# Altium schematic sheet Voltage Regulators.SchDoc
size A4; SheetNumber: 4; SheetTotal: 11
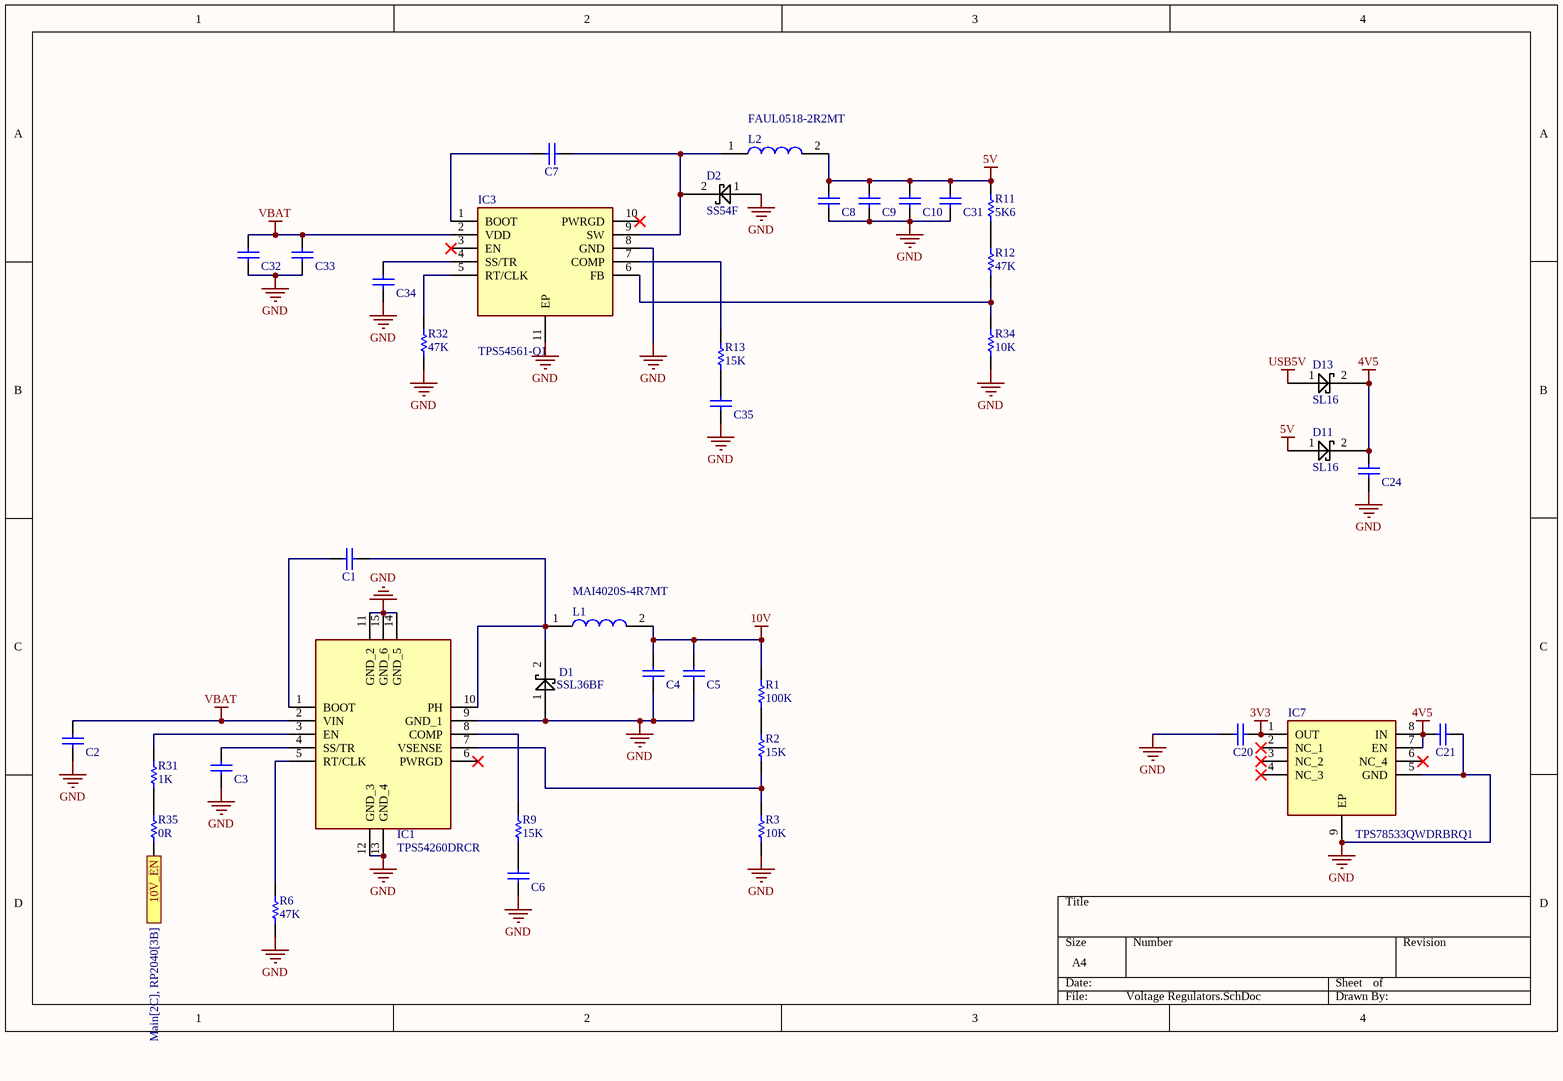
[diagram p0: Voltage Regulators.SchDoc]

## Parts
C1  100nF  [WCAP-CSGP_0603_L1.6W0.8H0.8_Reflow]  (value not drawn)
C2  3.3µF  [WCAP-CSGP_1206_L3.2W1.6H1.6]  (value not drawn)
C3  10nF  [WCAP-CSGP_0603_L1.6W0.8H0.8_Reflow]  (value not drawn)
C4  4.7µF  [WCAP-CSGP_0805_L2W1.25H1.25]  (value not drawn)
C5  4.7µF  [WCAP-CSGP_0805_L2W1.25H1.25]  (value not drawn)
C6  2.5pF  [WCAP-CSGP_0603_L1.6W0.8H0.8_Reflow]  (value not drawn)
C7  100nF  [WCAP-CSGP_0603_L1.6W0.8H0.8_Reflow]  (value not drawn)
C8  4.7µF  [WCAP-CSGP_0805_L2W1.25H1.25]  (value not drawn)
C9  4.7µF  [WCAP-CSGP_0805_L2W1.25H1.25]  (value not drawn)
C10  4.7µF  [WCAP-CSGP_0805_L2W1.25H1.25]  (value not drawn)
C20  1µF  [WCAP-CSGP_0603_L1.6W0.8H0.8_Reflow]  (value not drawn)
C21  1µF  [WCAP-CSGP_0603_L1.6W0.8H0.8_Reflow]  (value not drawn)
C24  1µF  [WCAP-CSGP_0603_L1.6W0.8H0.8_Reflow]  (value not drawn)
C31  4.7µF  [WCAP-CSGP_0805_L2W1.25H1.25]  (value not drawn)
C32  2.2µF  [WCAP-CSGP_0805_L2W1.25H1.25]  (value not drawn)
C33  2.2µF  [WCAP-CSGP_0805_L2W1.25H1.25]  (value not drawn)
C34  10nF  [WCAP-CSGP_0603_L1.6W0.8H0.8_Reflow]  (value not drawn)
C35  1nF  [WCAP-CSGP_0603_L1.6W0.8H0.8_Reflow]  (value not drawn)
D1  SSL36BF  [SSL36BF]
D2  SS54F  [SS54F]
D11  SL16  [SL16]
D13  SL16  [SL16]
IC1  TPS54260DRCR  [TPS54040ADRCT]
IC3  TPS54561-Q1  [SON80P400X400X80-11N]
IC7  TPS78533QWDRBRQ1  [SON65P300X300X100-9N-D]
L1  MAI4020S-4R7MT  [MAI4020S-4R7MT]
L2  FAUL0518-2R2MT  [FAUL0518-2R2MT]
R1  100K  [RESC0603(1608)_N]
R2  15K  [RESC0603(1608)_N]
R3  10K  [RESC0603(1608)_N]
R6  47K  [RESC0603(1608)_N]
R9  15K  [RESC0603(1608)_N]
R11  5K6  [RESC0603(1608)_N]
R12  47K  [RESC0603(1608)_N]
R13  15K  [RESC0603(1608)_N]
R31  1K  [RESC0603(1608)_N]
R32  47K  [RESC0603(1608)_N]
R34  10K  [RESC0603(1608)_N]
R35  0R  [RESC0603(1608)_N]

## Ports
10V_EN (see Main[2C], RP2040[3B])

## Nets
3V3: C20.2 IC7.1(OUT)
4V5: C21.1 C24.2 D11.2 D13.2 IC7.7(EN) IC7.8(IN)
5V: C8.2 C9.2 C10.2 C31.2 D11.1 L2.2 R11.2
10V: C4.2 C5.2 L1.2 R1.2
GND: C2.1 C3.1 C4.1 C5.1 C6.1 C8.1 C9.1 C10.1 C20.1 C21.2 C24.1 C31.1 C32.1 C33.1 C34.1 C35.1 D1.1 D2.1 IC1.9(GND_1) IC1.11(GND_2) IC1.12(GND_3) IC1.13(GND_4) IC1.14(GND_5) IC1.15(GND_6) IC3.8(GND) IC3.11(EP) IC7.5(GND) IC7.9(EP) R3.1 R6.1 R32.1 R34.1
USB5V: D13.1
VBAT: C2.2 C32.2 C33.2 IC1.2(VIN) IC3.2(VDD)
10V_EN: R35.1 ; port 10V_EN
NetC1_1: C1.1 IC1.1(BOOT)
NetC1_2: C1.2 D1.2 IC1.10(PH) L1.1
NetC3_2: C3.2 IC1.4(SS/TR)
NetC6_2: C6.2 R9.1
NetC7_1: C7.1 IC3.1(BOOT)
NetC7_2: C7.2 D2.2 IC3.9(SW) L2.1
NetC34_2: C34.2 IC3.4(SS/TR)
NetC35_2: C35.2 R13.1
NetIC1_3: IC1.3(EN) R31.2
NetIC1_5: IC1.5(RT/CLK) R6.2
NetIC1_7: IC1.7(VSENSE) R2.1 R3.2
NetIC1_8: IC1.8(COMP) R9.2
NetIC3_5: IC3.5(RT/CLK) R32.2
NetIC3_6: IC3.6(FB) R12.1 R34.2
NetIC3_7: IC3.7(COMP) R13.2
NetR1_1: R1.1 R2.2
NetR11_1: R11.1 R12.2
NetR31_1: R31.1 R35.2

Not connected (* = marked no-connect by the designer): IC1 6(PWRGD)*; IC3 3(EN)* 10(PWRGD)*; IC7 2(NC_1)* 3(NC_2)* 4(NC_3)* 6(NC_4)*

## Library data of the parts
C1 C7 = 885012206046: WCAP-CSGP Multilayer Ceramic Chip Capacitor, General Purpose, size 0603, X7R, 100nF, 16VDC; Manufacturer: Wurth Elektronik; Case/Size Code: 0603; Capacitance Tolerance: +/-10%; Dissipation Factor: 3.5%; Insulation Resistance: 5GΩ; Rated Voltage (DC): 16V; Technical Reference: X7R0603104K016DFCT10000; ComponentLink1Description: Website Link; ComponentLink1URL: https://www.we-online.com/redexpert/article/885012206046?ad; ComponentLink2Description: Datasheet Link; ComponentLink2URL: https://www.we-online.com/redexpert/spec/885012206046?ad; Manufacturer Part Number: 885012206046; Category: Multilayer Ceramic Chip Capacitors; Match Code: WCAP-CSGP; Mount: Surface Mount; Operating Temperature Max: 125°C; Operating Temperature Min: -55°C; Packaging: Tape and Reel; Length: 1.6mm; Width: 0.8mm; Height: 0.8mm; Capacitance: 100nF; Ceramic Type: X7R
C2 = 885012208124: TDK C3216X7S2A335KT000N / 3.3µF MLCC 1206 100V X7S; Manufacturer: Wurth Elektronik; Match Code: WCAP-CSGP; Case/Size Code: 1206; Capacitance: 2.2µF; Capacitance Tolerance: +/-10%; Ceramic Type: X7R; Dissipation Factor: 5%; Insulation Resistance: 0.05GΩ; Technical Reference: X7R1206225K100DFCT10000; ComponentLink1Description: Website Link; ComponentLink1URL: https://www.we-online.com/redexpert/article/885012208124?ad; ComponentLink2Description: Datasheet Link; ComponentLink2URL: https://www.we-online.com/redexpert/spec/885012208124?ad; Manufacturer Part Number: 885012208124; Category: Multilayer Ceramic Chip Capacitors; Mount: Surface Mount; Operating Temperature Max: 125°C; Operating Temperature Min: -55°C; Packaging: Tape and Reel; Length: 3.2mm; Width: 1.6mm; Height: 1.6mm; Rated Voltage (DC): 100V
C3 C34 = 885012206040: WCAP-CSGP Multilayer Ceramic Chip Capacitor, General Purpose, size 0603, X7R, 10nF, 16VDC; Manufacturer: Wurth Elektronik; Case/Size Code: 0603; Capacitance Tolerance: +/-10%; Dissipation Factor: 3.5%; Insulation Resistance: 10GΩ; Rated Voltage (DC): 16V; Technical Reference: X7R0603103K016DFCT10000; ComponentLink1Description: Website Link; ComponentLink1URL: https://www.we-online.com/redexpert/article/885012206040?ad; ComponentLink2Description: Datasheet Link; ComponentLink2URL: https://www.we-online.com/redexpert/spec/885012206040?ad; Manufacturer Part Number: 885012206040; Category: Multilayer Ceramic Chip Capacitors; Match Code: WCAP-CSGP; Mount: Surface Mount; Operating Temperature Max: 125°C; Operating Temperature Min: -55°C; Packaging: Tape and Reel; Length: 1.6mm; Width: 0.8mm; Height: 0.8mm; Capacitance: 10nF; Ceramic Type: X7R
C4 C5 C8-C10 C31 = 885012107013: CL21A475KAQNNNG; Manufacturer: Wurth Elektronik; Match Code: WCAP-CSGP; Case/Size Code: 0805; Capacitance Tolerance: +/-20%; Ceramic Type: X5R; Dissipation Factor: 10%; Insulation Resistance: 0.02GΩ; Rated Voltage (DC): 16V; Technical Reference: X5R0805475M016DFCT10000; ComponentLink1Description: Website Link; ComponentLink1URL: https://www.we-online.com/redexpert/article/885012107013?ad; ComponentLink2Description: Datasheet Link; ComponentLink2URL: https://www.we-online.com/redexpert/spec/885012107013?ad; Manufacturer Part Number: 885012107013; Category: Multilayer Ceramic Chip Capacitors; Mount: Surface Mount; Operating Temperature Max: 85°C; Operating Temperature Min: -55°C; Packaging: Tape and Reel; Length: 2mm; Width: 1.25mm; Height: 1.25mm; Capacitance: 4.7µF
C6 C35 = 885012006030: TCC0603COG2R5C500CT; Manufacturer: Wurth Elektronik; Match Code: WCAP-CSGP; Case/Size Code: 0603; Capacitance: 4.7pF; Capacitance Tolerance: +/-0.5pF; Ceramic Type: NP0; Insulation Resistance: 10GΩ; Q Factor: 494; Rated Voltage (DC): 25V; Technical Reference: NP006034R7D025DFCT10000; ComponentLink1Description: Website Link; ComponentLink1URL: https://www.we-online.com/redexpert/article/885012006030?ad; ComponentLink2Description: Datasheet Link; ComponentLink2URL: https://www.we-online.com/redexpert/spec/885012006030?ad; Manufacturer Part Number: 885012006030; Category: Multilayer Ceramic Chip Capacitors; Mount: Surface Mount; Operating Temperature Max: 125°C; Operating Temperature Min: -55°C; Packaging: Tape and Reel; Length: 1.6mm; Width: 0.8mm; Height: 0.8mm
C20 C21 = 885012206026: WCAP-CSGP Multilayer Ceramic Chip Capacitor, General Purpose, size 0603, X7R, 1µF, 10VDC; Manufacturer: Wurth Elektronik; Case/Size Code: 0603; Capacitance Tolerance: +/-10%; Dissipation Factor: 10%; Insulation Resistance: 0.1GΩ; Rated Voltage (DC): 10V; Technical Reference: X7R0603105K010DFCT10000; ComponentLink1Description: Website Link; ComponentLink1URL: https://www.we-online.com/redexpert/article/885012206026?ad; ComponentLink2Description: Datasheet Link; ComponentLink2URL: https://www.we-online.com/redexpert/spec/885012206026?ad; Manufacturer Part Number: 885012206026; Category: Multilayer Ceramic Chip Capacitors; Match Code: WCAP-CSGP; Mount: Surface Mount; Operating Temperature Max: 125°C; Operating Temperature Min: -55°C; Packaging: Tape and Reel; Length: 1.6mm; Width: 0.8mm; Height: 0.8mm; Capacitance: 1µF; Ceramic Type: X7R
C24 = 885012106017: WCAP-CSGP Multilayer Ceramic Chip Capacitor, General Purpose, size 0603, X5R, 1µF, 16VDC; Manufacturer: Wurth Elektronik; Case/Size Code: 0603; Capacitance Tolerance: +/-20%; Dissipation Factor: 10%; Insulation Resistance: 0.1GΩ; Rated Voltage (DC): 16V; Technical Reference: X5R0603105M016DFCT10000; ComponentLink1Description: Website Link; ComponentLink1URL: https://www.we-online.com/redexpert/article/885012106017?ad; ComponentLink2Description: Datasheet Link; ComponentLink2URL: https://www.we-online.com/redexpert/spec/885012106017?ad; Manufacturer Part Number: 885012106017; Category: Multilayer Ceramic Chip Capacitors; Match Code: WCAP-CSGP; Mount: Surface Mount; Operating Temperature Max: 85°C; Operating Temperature Min: -55°C; Packaging: Tape and Reel; Length: 1.6mm; Width: 0.8mm; Height: 0.8mm; Capacitance: 1µF; Ceramic Type: X5R
C32 C33 = 885012107013: CL21B225KBYNNNE; Manufacturer: Wurth Elektronik; Match Code: WCAP-CSGP; Case/Size Code: 0805; Capacitance: 4.7µF; Capacitance Tolerance: +/-20%; Ceramic Type: X5R; Dissipation Factor: 10%; Insulation Resistance: 0.02GΩ; Rated Voltage (DC): 16V; Technical Reference: X5R0805475M016DFCT10000; ComponentLink1Description: Website Link; ComponentLink1URL: https://www.we-online.com/redexpert/article/885012107013?ad; ComponentLink2Description: Datasheet Link; ComponentLink2URL: https://www.we-online.com/redexpert/spec/885012107013?ad; Manufacturer Part Number: 885012107013; Category: Multilayer Ceramic Chip Capacitors; Mount: Surface Mount; Operating Temperature Max: 85°C; Operating Temperature Min: -55°C; Packaging: Tape and Reel; Length: 2mm; Width: 1.25mm; Height: 1.25mm
IC1 = TPS54260DRCR: Integrated Circuit; Manufacturer_Name: Texas Instruments; Datasheet Link: http://www.ti.com/lit/gpn/TPS54040A; Height: 1mm; Manufacturer_Part_Number: TPS54260DRCR; Mouser Part Number: 595-TPS54260DRCR; Mouser Price/Stock: https://www.mouser.co.uk/ProductDetail/Texas-Instruments/TPS54260DRCR?qs=O1HRStiETChM7xK%2FSiuP6w%3D%3D; Arrow Part Number: TPS54260DRCR; Arrow Price/Stock: https://www.arrow.com/en/products/tps54260drcr/texas-instruments?region=nac
IC3 = TPS54561-Q1: Integrated Circuit; Manufacturer_Name: Texas Instruments; Datasheet Link: http://www.ti.com/lit/gpn/tps54561-q1; Height: 0.8mm; Manufacturer_Part_Number: TPS54561-Q1
IC7 = TPS78533QWDRBRQ1: Integrated Circuit; Manufacturer_Name: Texas Instruments; Datasheet Link: https://www.arrow.com/en/products/tps78533qwdrbrq1/texas-instruments?region=nac; Height: 1mm; Manufacturer_Part_Number: TPS78533QWDRBRQ1; Mouser Part Number: 595-TPS78533QWDRBRQ1; Mouser Price/Stock: https://www.mouser.co.uk/ProductDetail/Texas-Instruments/TPS78533QWDRBRQ1?qs=iLbezkQI%252BsiNbdqh2Ko9GQ%3D%3D; Arrow Part Number: TPS78533QWDRBRQ1; Arrow Price/Stock: https://www.arrow.com/en/products/tps78533qwdrbrq1/texas-instruments?region=nac
R1 = Res 100K: Chipwiderstand, SMD, Baureihe MC, 1%; Manufacturer: Multicomp; PackageReference: 0603; Value: 100K; OC_FARNELL: 9330402
R2 R9 R12 R13 = Res 12K: Chipwiderstand, SMD, Baureihe MC, 1%; Manufacturer: Multicomp; Value: 12K; PackageReference: 0603; OC_FARNELL: 9330518
R3 R34 = Res 10K: Chipwiderstand, SMD, Baureihe MC, 1%; Manufacturer: Multicomp; PackageReference: 0603; Value: 10K; OC_FARNELL: 9330399
R6 R32 = Res 47R: Chipwiderstand, SMD, Baureihe MC, 1%; Manufacturer: Multicomp; Value: 47R; PackageReference: 0603; OC_FARNELL: 1576259
R11 = Res 100K: Chipwiderstand, SMD, Baureihe MC, 1%; Manufacturer: Multicomp; Value: 100K; PackageReference: 0603; OC_FARNELL: 9330402
R31 = Res 1K: Chipwiderstand, SMD, Baureihe MC, 1%; Manufacturer: Multicomp; PackageReference: 0603; Value: 1K; OC_FARNELL: 9330380
R35 = Res 0R: Chipwiderstand, SMD, Baureihe MC, 1%; Manufacturer: Multicomp; PackageReference: 0603; Value: 0R; OC_FARNELL: 9331662